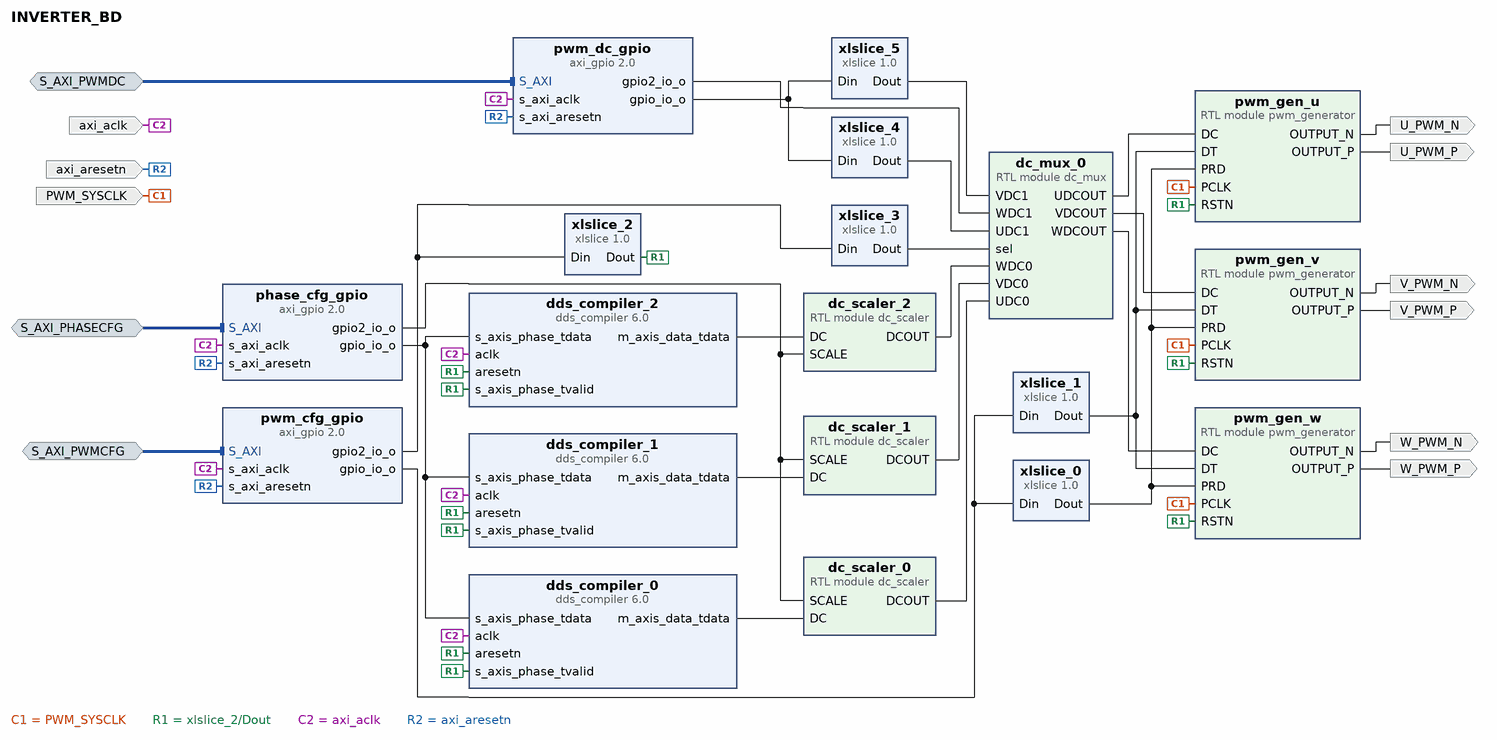
[diagram p0: block diagram of the top level]
# Vivado block design INVERTER_BD, xc7z020clg400-1, Vivado 2021.2
create_bd_design INVERTER_BD

create_bd_intf_port -mode Slave -vlnv xilinx.com:interface:aximm_rtl:1.0 S_AXI_PWMCFG
set_property -dict [list \
  CONFIG.ADDR_WIDTH 16 \
  CONFIG.ARUSER_WIDTH 0 \
  CONFIG.AWUSER_WIDTH 0 \
  CONFIG.BUSER_WIDTH 0 \
  CONFIG.DATA_WIDTH 32 \
  CONFIG.HAS_BRESP 1 \
  CONFIG.HAS_BURST 0 \
  CONFIG.HAS_CACHE 0 \
  CONFIG.HAS_LOCK 0 \
  CONFIG.HAS_PROT 0 \
  CONFIG.HAS_QOS 0 \
  CONFIG.HAS_REGION 0 \
  CONFIG.HAS_RRESP 1 \
  CONFIG.HAS_WSTRB 1 \
  CONFIG.ID_WIDTH 0 \
  CONFIG.MAX_BURST_LENGTH 1 \
  CONFIG.NUM_READ_OUTSTANDING 1 \
  CONFIG.NUM_READ_THREADS 1 \
  CONFIG.NUM_WRITE_OUTSTANDING 1 \
  CONFIG.NUM_WRITE_THREADS 1 \
  CONFIG.PROTOCOL AXI4LITE \
  CONFIG.READ_WRITE_MODE READ_WRITE \
  CONFIG.RUSER_BITS_PER_BYTE 0 \
  CONFIG.RUSER_WIDTH 0 \
  CONFIG.SUPPORTS_NARROW_BURST 0 \
  CONFIG.WUSER_BITS_PER_BYTE 0 \
  CONFIG.WUSER_WIDTH 0 \
] [get_bd_intf_ports S_AXI_PWMCFG]
create_bd_intf_port -mode Slave -vlnv xilinx.com:interface:aximm_rtl:1.0 S_AXI_PHASECFG
set_property -dict [list \
  CONFIG.ADDR_WIDTH 16 \
  CONFIG.ARUSER_WIDTH 0 \
  CONFIG.AWUSER_WIDTH 0 \
  CONFIG.BUSER_WIDTH 0 \
  CONFIG.DATA_WIDTH 32 \
  CONFIG.HAS_BRESP 1 \
  CONFIG.HAS_BURST 0 \
  CONFIG.HAS_CACHE 0 \
  CONFIG.HAS_LOCK 0 \
  CONFIG.HAS_PROT 0 \
  CONFIG.HAS_QOS 0 \
  CONFIG.HAS_REGION 0 \
  CONFIG.HAS_RRESP 1 \
  CONFIG.HAS_WSTRB 1 \
  CONFIG.ID_WIDTH 0 \
  CONFIG.MAX_BURST_LENGTH 1 \
  CONFIG.NUM_READ_OUTSTANDING 1 \
  CONFIG.NUM_READ_THREADS 1 \
  CONFIG.NUM_WRITE_OUTSTANDING 1 \
  CONFIG.NUM_WRITE_THREADS 1 \
  CONFIG.PROTOCOL AXI4LITE \
  CONFIG.READ_WRITE_MODE READ_WRITE \
  CONFIG.RUSER_BITS_PER_BYTE 0 \
  CONFIG.RUSER_WIDTH 0 \
  CONFIG.SUPPORTS_NARROW_BURST 0 \
  CONFIG.WUSER_BITS_PER_BYTE 0 \
  CONFIG.WUSER_WIDTH 0 \
] [get_bd_intf_ports S_AXI_PHASECFG]
create_bd_intf_port -mode Slave -vlnv xilinx.com:interface:aximm_rtl:1.0 S_AXI_PWMDC
set_property -dict [list \
  CONFIG.ADDR_WIDTH 16 \
  CONFIG.ARUSER_WIDTH 0 \
  CONFIG.AWUSER_WIDTH 0 \
  CONFIG.BUSER_WIDTH 0 \
  CONFIG.DATA_WIDTH 32 \
  CONFIG.HAS_BRESP 1 \
  CONFIG.HAS_BURST 0 \
  CONFIG.HAS_CACHE 0 \
  CONFIG.HAS_LOCK 0 \
  CONFIG.HAS_PROT 0 \
  CONFIG.HAS_QOS 0 \
  CONFIG.HAS_REGION 0 \
  CONFIG.HAS_RRESP 1 \
  CONFIG.HAS_WSTRB 1 \
  CONFIG.ID_WIDTH 0 \
  CONFIG.MAX_BURST_LENGTH 1 \
  CONFIG.NUM_READ_OUTSTANDING 1 \
  CONFIG.NUM_READ_THREADS 1 \
  CONFIG.NUM_WRITE_OUTSTANDING 1 \
  CONFIG.NUM_WRITE_THREADS 1 \
  CONFIG.PROTOCOL AXI4LITE \
  CONFIG.READ_WRITE_MODE READ_WRITE \
  CONFIG.RUSER_BITS_PER_BYTE 0 \
  CONFIG.RUSER_WIDTH 0 \
  CONFIG.SUPPORTS_NARROW_BURST 0 \
  CONFIG.WUSER_BITS_PER_BYTE 0 \
  CONFIG.WUSER_WIDTH 0 \
] [get_bd_intf_ports S_AXI_PWMDC]
create_bd_port -dir I -type clk PWM_SYSCLK
set_property -dict {CONFIG.FREQ_HZ 100000000} [get_bd_ports PWM_SYSCLK]
create_bd_port -dir I -type clk axi_aclk
set_property -dict [list \
  CONFIG.ASSOCIATED_BUSIF S_AXI_PWMCFG:S_AXI_PHASECFG:S_AXI_PWMDC \
  CONFIG.FREQ_HZ 100000000 \
] [get_bd_ports axi_aclk]
create_bd_port -dir I -type rst axi_aresetn
create_bd_port -dir O U_PWM_P
create_bd_port -dir O U_PWM_N
create_bd_port -dir O V_PWM_N
create_bd_port -dir O V_PWM_P
create_bd_port -dir O W_PWM_N
create_bd_port -dir O W_PWM_P

create_bd_cell -type ip -vlnv xilinx.com:ip:axi_gpio:2.0 pwm_cfg_gpio
set_property -dict [list \
  CONFIG.C_ALL_OUTPUTS 1 \
  CONFIG.C_ALL_OUTPUTS_2 1 \
  CONFIG.C_GPIO2_WIDTH 2 \
  CONFIG.C_IS_DUAL 1 \
] [get_bd_cells pwm_cfg_gpio]
create_bd_cell -type ip -vlnv xilinx.com:ip:xlslice:1.0 xlslice_0
set_property -dict {CONFIG.DIN_FROM 15 CONFIG.DOUT_WIDTH 16} [get_bd_cells xlslice_0]
create_bd_cell -type ip -vlnv xilinx.com:ip:xlslice:1.0 xlslice_1
set_property -dict {CONFIG.DIN_FROM 31 CONFIG.DIN_TO 16 CONFIG.DOUT_WIDTH 16} [get_bd_cells xlslice_1]
create_bd_cell -type ip -vlnv xilinx.com:ip:axi_gpio:2.0 phase_cfg_gpio
set_property -dict [list \
  CONFIG.C_ALL_OUTPUTS 1 \
  CONFIG.C_ALL_OUTPUTS_2 1 \
  CONFIG.C_GPIO2_WIDTH 16 \
  CONFIG.C_IS_DUAL 1 \
] [get_bd_cells phase_cfg_gpio]
create_bd_cell -type ip -vlnv xilinx.com:ip:xlslice:1.0 xlslice_2
set_property -dict {CONFIG.DIN_WIDTH 2} [get_bd_cells xlslice_2]
create_bd_cell -type ip -vlnv xilinx.com:ip:xlslice:1.0 xlslice_3
set_property -dict {CONFIG.DIN_FROM 1 CONFIG.DIN_TO 1 CONFIG.DIN_WIDTH 2} [get_bd_cells xlslice_3]
create_bd_cell -type module -reference dc_mux dc_mux_0
create_bd_cell -type ip -vlnv xilinx.com:ip:axi_gpio:2.0 pwm_dc_gpio
set_property -dict [list \
  CONFIG.C_ALL_OUTPUTS 1 \
  CONFIG.C_ALL_OUTPUTS_2 1 \
  CONFIG.C_GPIO2_WIDTH 16 \
  CONFIG.C_IS_DUAL 1 \
] [get_bd_cells pwm_dc_gpio]
create_bd_cell -type ip -vlnv xilinx.com:ip:xlslice:1.0 xlslice_4
set_property -dict {CONFIG.DIN_FROM 15 CONFIG.DOUT_WIDTH 16} [get_bd_cells xlslice_4]
create_bd_cell -type ip -vlnv xilinx.com:ip:xlslice:1.0 xlslice_5
set_property -dict {CONFIG.DIN_FROM 31 CONFIG.DIN_TO 16 CONFIG.DOUT_WIDTH 16} [get_bd_cells xlslice_5]
create_bd_cell -type ip -vlnv xilinx.com:ip:dds_compiler:6.0 dds_compiler_0
set_property -dict [list \
  CONFIG.DATA_Has_TLAST Not_Required \
  CONFIG.Has_ARESETn true \
  CONFIG.Has_Phase_Out false \
  CONFIG.Latency 8 \
  CONFIG.M_DATA_Has_TUSER Not_Required \
  CONFIG.Noise_Shaping None \
  CONFIG.Output_Frequency1 0 \
  CONFIG.Output_Selection Sine \
  CONFIG.Output_Width 16 \
  CONFIG.PINC1 0 \
  CONFIG.Parameter_Entry Hardware_Parameters \
  CONFIG.Phase_Increment Streaming \
  CONFIG.Phase_Width 32 \
  CONFIG.Phase_offset Fixed \
  CONFIG.S_PHASE_Has_TUSER Not_Required \
] [get_bd_cells dds_compiler_0]
create_bd_cell -type ip -vlnv xilinx.com:ip:dds_compiler:6.0 dds_compiler_1
set_property -dict [list \
  CONFIG.DATA_Has_TLAST Not_Required \
  CONFIG.Has_ARESETn true \
  CONFIG.Has_Phase_Out false \
  CONFIG.Latency 8 \
  CONFIG.M_DATA_Has_TUSER Not_Required \
  CONFIG.Noise_Shaping None \
  CONFIG.Output_Frequency1 0 \
  CONFIG.Output_Selection Sine \
  CONFIG.Output_Width 16 \
  CONFIG.PINC1 0 \
  CONFIG.POFF1 10101010101010101010101010101010 \
  CONFIG.Parameter_Entry Hardware_Parameters \
  CONFIG.Phase_Increment Streaming \
  CONFIG.Phase_Width 32 \
  CONFIG.Phase_offset Fixed \
  CONFIG.S_PHASE_Has_TUSER Not_Required \
] [get_bd_cells dds_compiler_1]
create_bd_cell -type ip -vlnv xilinx.com:ip:dds_compiler:6.0 dds_compiler_2
set_property -dict [list \
  CONFIG.DATA_Has_TLAST Not_Required \
  CONFIG.Has_ARESETn true \
  CONFIG.Has_Phase_Out false \
  CONFIG.Latency 8 \
  CONFIG.M_DATA_Has_TUSER Not_Required \
  CONFIG.Noise_Shaping None \
  CONFIG.Output_Frequency1 0 \
  CONFIG.Output_Selection Sine \
  CONFIG.Output_Width 16 \
  CONFIG.PINC1 0 \
  CONFIG.POFF1 01010101010101010101010101010101 \
  CONFIG.Parameter_Entry Hardware_Parameters \
  CONFIG.Phase_Increment Streaming \
  CONFIG.Phase_Width 32 \
  CONFIG.Phase_offset Fixed \
  CONFIG.S_PHASE_Has_TUSER Not_Required \
] [get_bd_cells dds_compiler_2]
create_bd_cell -type module -reference pwm_generator pwm_gen_u
create_bd_cell -type module -reference pwm_generator pwm_gen_v
create_bd_cell -type module -reference pwm_generator pwm_gen_w
create_bd_cell -type module -reference dc_scaler dc_scaler_0
create_bd_cell -type module -reference dc_scaler dc_scaler_1
create_bd_cell -type module -reference dc_scaler dc_scaler_2

# ---- connections ----

connect_bd_intf_net -intf_net S_AXI_0_1 [get_bd_intf_ports S_AXI_PWMCFG] [get_bd_intf_pins pwm_cfg_gpio/S_AXI]
connect_bd_intf_net -intf_net S_AXI_0_2 [get_bd_intf_ports S_AXI_PHASECFG] [get_bd_intf_pins phase_cfg_gpio/S_AXI]
connect_bd_intf_net -intf_net S_AXI_0_3 [get_bd_intf_ports S_AXI_PWMDC] [get_bd_intf_pins pwm_dc_gpio/S_AXI]
connect_bd_net [get_bd_ports PWM_SYSCLK] [get_bd_pins pwm_gen_u/PCLK] [get_bd_pins pwm_gen_v/PCLK] [get_bd_pins pwm_gen_w/PCLK]
connect_bd_net [get_bd_pins xlslice_2/Dout] \
  [get_bd_pins dds_compiler_1/s_axis_phase_tvalid] [get_bd_pins dds_compiler_2/s_axis_phase_tvalid] \
  [get_bd_pins dds_compiler_0/s_axis_phase_tvalid] [get_bd_pins dds_compiler_0/aresetn] [get_bd_pins dds_compiler_2/aresetn] \
  [get_bd_pins dds_compiler_1/aresetn] [get_bd_pins pwm_gen_u/RSTN] [get_bd_pins pwm_gen_v/RSTN] [get_bd_pins pwm_gen_w/RSTN]
connect_bd_net [get_bd_pins phase_cfg_gpio/gpio2_io_o] [get_bd_pins dc_scaler_0/SCALE] [get_bd_pins dc_scaler_1/SCALE] [get_bd_pins dc_scaler_2/SCALE]
connect_bd_net [get_bd_ports axi_aclk] \
  [get_bd_pins pwm_cfg_gpio/s_axi_aclk] [get_bd_pins phase_cfg_gpio/s_axi_aclk] [get_bd_pins pwm_dc_gpio/s_axi_aclk] \
  [get_bd_pins dds_compiler_2/aclk] [get_bd_pins dds_compiler_1/aclk] [get_bd_pins dds_compiler_0/aclk]
connect_bd_net [get_bd_ports axi_aresetn] \
  [get_bd_pins pwm_cfg_gpio/s_axi_aresetn] [get_bd_pins phase_cfg_gpio/s_axi_aresetn] [get_bd_pins pwm_dc_gpio/s_axi_aresetn]
connect_bd_net [get_bd_pins dc_mux_0/UDCOUT] [get_bd_pins pwm_gen_u/DC]
connect_bd_net [get_bd_pins dc_mux_0/VDCOUT] [get_bd_pins pwm_gen_v/DC]
connect_bd_net [get_bd_pins dc_mux_0/WDCOUT] [get_bd_pins pwm_gen_w/DC]
connect_bd_net [get_bd_pins dc_scaler_0/DCOUT] [get_bd_pins dc_mux_0/UDC0]
connect_bd_net [get_bd_pins dc_scaler_1/DCOUT] [get_bd_pins dc_mux_0/VDC0]
connect_bd_net [get_bd_pins dc_scaler_2/DCOUT] [get_bd_pins dc_mux_0/WDC0]
connect_bd_net [get_bd_pins dds_compiler_0/m_axis_data_tdata] [get_bd_pins dc_scaler_0/DC]
connect_bd_net [get_bd_pins dds_compiler_1/m_axis_data_tdata] [get_bd_pins dc_scaler_1/DC]
connect_bd_net [get_bd_pins dds_compiler_2/m_axis_data_tdata] [get_bd_pins dc_scaler_2/DC]
connect_bd_net [get_bd_pins phase_cfg_gpio/gpio_io_o] \
  [get_bd_pins dds_compiler_0/s_axis_phase_tdata] [get_bd_pins dds_compiler_2/s_axis_phase_tdata] \
  [get_bd_pins dds_compiler_1/s_axis_phase_tdata]
connect_bd_net [get_bd_pins pwm_cfg_gpio/gpio2_io_o] [get_bd_pins xlslice_2/Din] [get_bd_pins xlslice_3/Din]
connect_bd_net [get_bd_pins pwm_dc_gpio/gpio2_io_o] [get_bd_pins dc_mux_0/WDC1]
connect_bd_net [get_bd_pins pwm_dc_gpio/gpio_io_o] [get_bd_pins xlslice_4/Din] [get_bd_pins xlslice_5/Din]
connect_bd_net [get_bd_pins pwm_gen_u/OUTPUT_N] [get_bd_ports U_PWM_N]
connect_bd_net [get_bd_pins pwm_gen_u/OUTPUT_P] [get_bd_ports U_PWM_P]
connect_bd_net [get_bd_pins pwm_gen_v/OUTPUT_N] [get_bd_ports V_PWM_N]
connect_bd_net [get_bd_pins pwm_gen_v/OUTPUT_P] [get_bd_ports V_PWM_P]
connect_bd_net [get_bd_pins pwm_gen_w/OUTPUT_N] [get_bd_ports W_PWM_N]
connect_bd_net [get_bd_pins pwm_gen_w/OUTPUT_P] [get_bd_ports W_PWM_P]
connect_bd_net -net pwm_timing_cfg_gpio_gpio_io_o [get_bd_pins pwm_cfg_gpio/gpio_io_o] [get_bd_pins xlslice_0/Din] [get_bd_pins xlslice_1/Din]
connect_bd_net [get_bd_pins xlslice_0/Dout] [get_bd_pins pwm_gen_u/PRD] [get_bd_pins pwm_gen_v/PRD] [get_bd_pins pwm_gen_w/PRD]
connect_bd_net [get_bd_pins xlslice_1/Dout] [get_bd_pins pwm_gen_u/DT] [get_bd_pins pwm_gen_v/DT] [get_bd_pins pwm_gen_w/DT]
connect_bd_net [get_bd_pins xlslice_3/Dout] [get_bd_pins dc_mux_0/sel]
connect_bd_net [get_bd_pins xlslice_4/Dout] [get_bd_pins dc_mux_0/UDC1]
connect_bd_net [get_bd_pins xlslice_5/Dout] [get_bd_pins dc_mux_0/VDC1]

# ---- address map ----
assign_bd_address -offset 0x0000 -range 64K -target_address_space [get_bd_addr_spaces S_AXI_PHASECFG] [get_bd_addr_segs phase_cfg_gpio/S_AXI/Reg]
assign_bd_address -offset 0x0000 -range 4K -target_address_space [get_bd_addr_spaces S_AXI_PWMCFG] [get_bd_addr_segs pwm_cfg_gpio/S_AXI/Reg]
assign_bd_address -offset 0x0000 -range 64K -target_address_space [get_bd_addr_spaces S_AXI_PWMDC] [get_bd_addr_segs pwm_dc_gpio/S_AXI/Reg]

validate_bd_design
save_bd_design
